# Altium schematic sheet MINIRACER-SERIALS.SchDoc
size A4
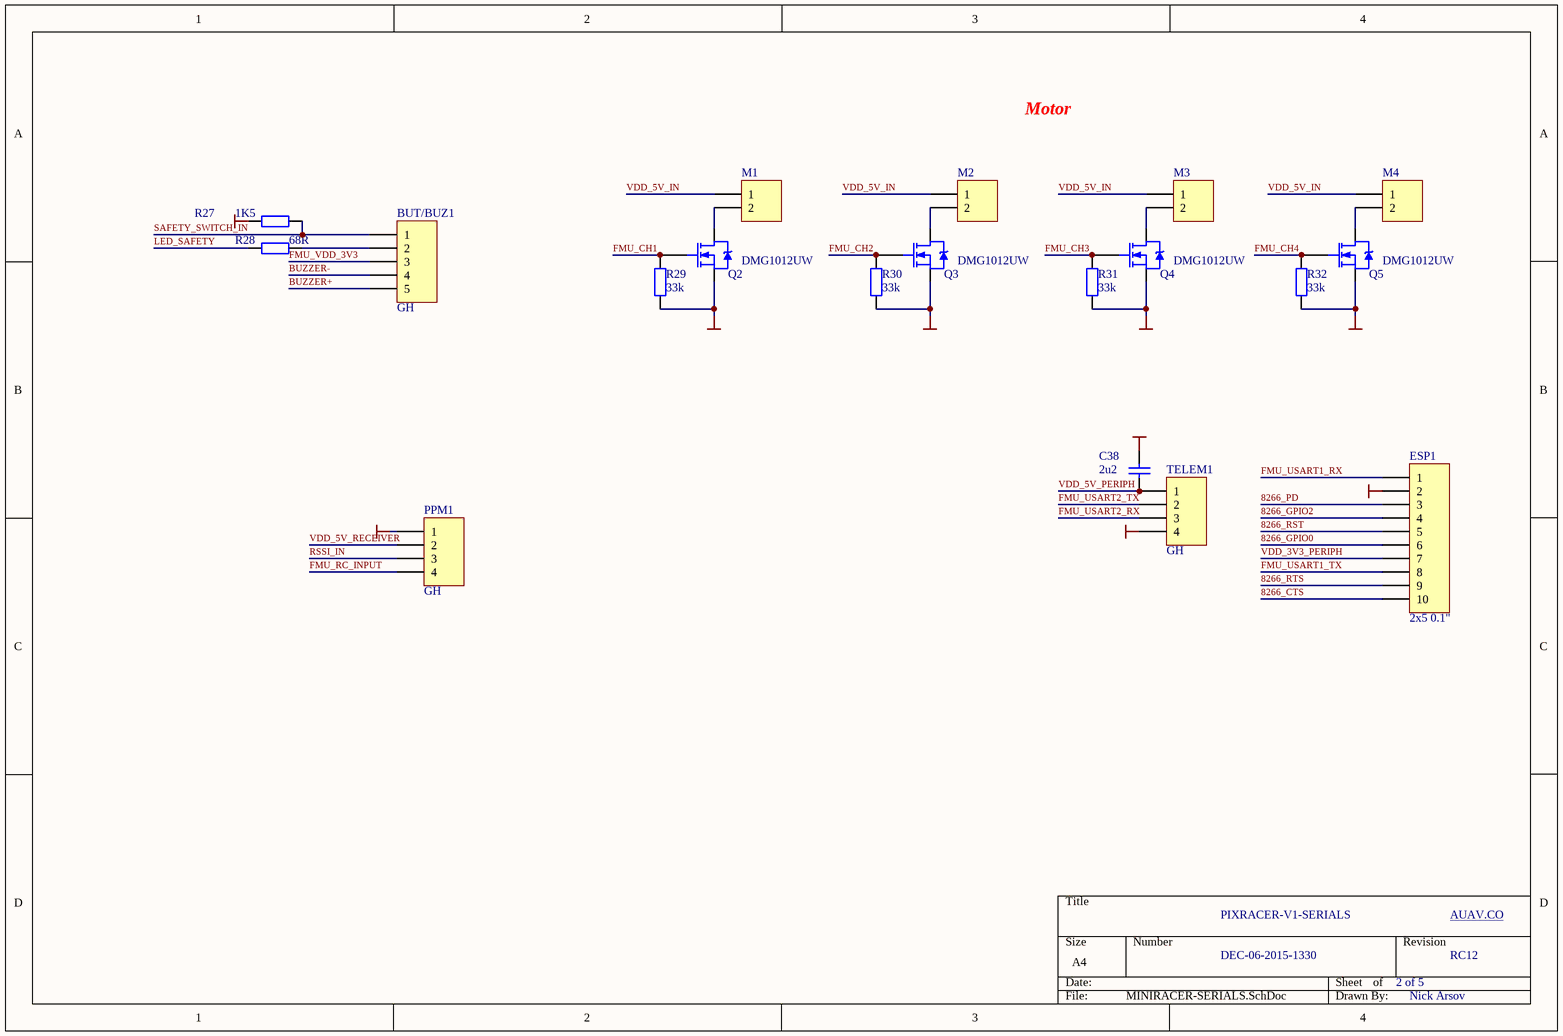
[diagram p0: MINIRACER-SERIALS.SchDoc]

## Parts
BUT/BUZ1  GH  [HDR1X5]
C38  2u2  [0402A]
ESP1  2x5 0.1"  [2.54mm_10pin_SMD]
M1  (no value)  [HDR1X2]
M2  (no value)  [HDR1X2]
M3  (no value)  [HDR1X2]
M4  (no value)  [HDR1X2]
PPM1  GH  [HDR1X4]
Q2  DMG1012UW  [2N7002-SOT323]
Q3  DMG1012UW  [2N7002-SOT323]
Q4  DMG1012UW  [2N7002-SOT323]
Q5  DMG1012UW  [2N7002-SOT323]
R27  1K5  [0402A]
R28  68R  [0402A]
R29  33k  [0402A]
R30  33k  [0402A]
R31  33k  [0402A]
R32  33k  [0402A]
TELEM1  GH  [HDR1X4]

## Nets
GND: C38.2 ESP1.2 PPM1.1 Q2.2(S) Q3.2(S) Q4.2(S) Q5.2(S) R27.2 R29.2 R30.2 R31.2 R32.2 TELEM1.4
8266_CTS: ESP1.10
8266_GPIO0: ESP1.6
8266_GPIO2: ESP1.4
8266_PD: ESP1.3
8266_RST: ESP1.5
8266_RTS: ESP1.9
BUZZER+: BUT/BUZ1.5
BUZZER-: BUT/BUZ1.4
FMU_CH1: Q2.3(G) R29.1
FMU_CH2: Q3.3(G) R30.1
FMU_CH3: Q4.3(G) R31.1
FMU_CH4: Q5.3(G) R32.1
FMU_RC_INPUT: PPM1.4
FMU_USART1_RX: ESP1.1
FMU_USART1_TX: ESP1.8
FMU_USART2_RX: TELEM1.3
FMU_USART2_TX: TELEM1.2
FMU_VDD_3V3: BUT/BUZ1.3
LED_SAFETY: R28.2
RSSI_IN: PPM1.3
SAFETY_SWITCH_IN: BUT/BUZ1.1 R27.1
VDD_3V3_PERIPH: ESP1.7
VDD_5V_IN: M1.1 M2.1 M3.1 M4.1
VDD_5V_PERIPH: C38.1 TELEM1.1
VDD_5V_RECEIVER: PPM1.2
NetBUT/BUZ1_2: BUT/BUZ1.2 R28.1
NetM1_2: M1.2 Q2.1(D)
NetM2_2: M2.2 Q3.1(D)
NetM3_2: M3.2 Q4.1(D)
NetM4_2: M4.2 Q5.1(D)

## Notes on the sheet
- Motor
- PIXRACER-V1-SERIALS
- AUAV.CO
- DEC-06-2015-1330
- 2 of 5
- RC12
- Nick Arsov

## Library data of the parts
BUT/BUZ1 = Header 5: Header, 5-Pin; LatestRevisionDate: 17-Jul-2002; LatestRevisionNote: Re-released for DXP Platform.; Publisher: Altium Limited
C38 = Cap: Capacitor; Value: 100pF; Published: 8-Jun-2000; LatestRevisionDate: 17-Jul-2002; LatestRevisionNote: Re-released for DXP Platform.; PackageReference: RAD-0.3; Publisher: Altium Limited
ESP1 = Header 10: Header, 10-Pin; LatestRevisionDate: 17-Jul-2002; LatestRevisionNote: Re-released for DXP Platform.; Publisher: Altium Limited
M1-M4 = Header 2: Header, 2-Pin; LatestRevisionDate: 17-Jul-2002; LatestRevisionNote: Re-released for DXP Platform.; Publisher: Altium Limited
PPM1 TELEM1 = Header 4: Header, 4-Pin; LatestRevisionDate: 17-Jul-2002; LatestRevisionNote: Re-released for DXP Platform.; Publisher: Altium Limited
Q2-Q5 = NMOS-2: N-Channel Power MOSFET; Note: Pin 2 is electrically connected to pin 4.; Published: 8-Jun-2000; LatestRevisionDate: 17-Jul-2002; LatestRevisionNote: Re-released for DXP Platform.; DatasheetDocument: PD-9.814; PackageReference: TO-220AB; Publisher: Altium Limited; Code_JEDEC: TO-220-AB; ComponentLink1Description: Manufacturer Link; ComponentLink1URL: http://www.irf.com/
R27-R32 = Res2: Resistor; Value: 1K; Published: 8-Jun-2000; LatestRevisionDate: 17-Jul-2002; LatestRevisionNote: Re-released for DXP Platform.; PackageReference: AXIAL-0.4; Publisher: Altium Limited
  R29-R32: PackageDescription: Axial Device, Thru-Hole; 2 Leads; 0.4 in Pin Spacing